# Altium schematic sheet LED.SchDoc
size A4; SheetNumber: 11; SheetTotal: 15
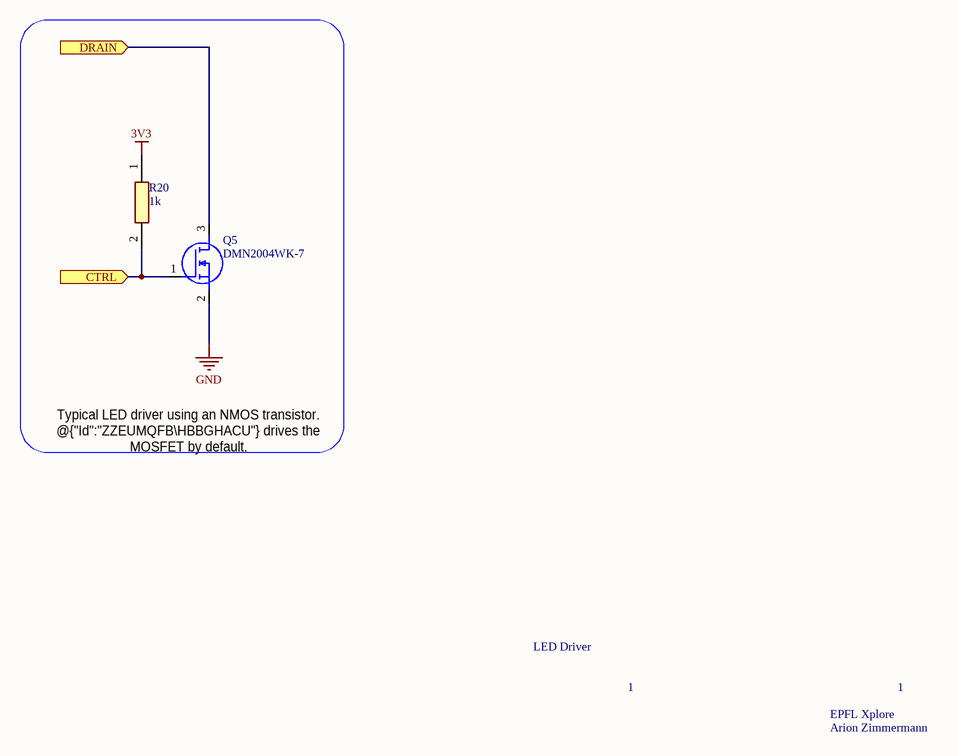
[diagram p0: LED.SchDoc]

## Parts
Q5  DMN2004WK-7  [SOT65P210X110-3N]
R20  value 1k  [RESC1608X55N]  (hidden comment: CRCW060349K9FKEAC)

## Ports
CTRL (in), DRAIN (in)

## Nets
3V3: R20.1
GND: Q5.2(S)
CTRL: Q5.1(G) R20.2 ; port CTRL
DRAIN: Q5.3(D) ; port DRAIN

## Notes on the sheet
- Typical LED driver using an NMOS transistor. @{"Id":"ZZEUMQFB\HBBGHACU"} drives the MOSFET by default.
- LED Driver
- 1
- EPFL Xplore
- Arion Zimmermann

## Library data of the parts
Q5 = DMN2004WK-7: MOSFET (N-Channel); Manufacturer_Name: Diodes Inc.; Datasheet Link: https://www.arrow.com/en/products/dmn2004wk-7/diodes-incorporated; Height: 1.1mm; Manufacturer_Part_Number: DMN2004WK-7; Mouser Part Number: 621-DMN2004WK-7; Mouser Price/Stock: https://www.mouser.co.uk/ProductDetail/Diodes-Incorporated/DMN2004WK-7?qs=mQbszxtPdlNeJRFooqJmcQ%3D%3D; Arrow Part Number: DMN2004WK-7; Arrow Price/Stock: null?region=asia
R20 = CRCW06031K00JNEAC: Resistor; Manufacturer_Name: Vishay; Datasheet Link: http://www.vishay.com/docs/28773/crcwce3.pdf; Height: 0.55mm; Manufacturer_Part_Number: CRCW06031K00JNEAC; Mouser Part Number: 71-CRCW06031K00JNEAC; Mouser Price/Stock: https://www.mouser.co.uk/ProductDetail/Vishay-Dale/CRCW06031K00JNEAC?qs=E3Y5ESvWgWPM5t3DlmyFHQ%3D%3D; Arrow Part Number: CRCW06031K00JNEAC; Arrow Price/Stock: https://www.arrow.com/en/products/crcw06031k00jneac/vishay?region=nac